# Altium schematic sheet 3_MCU.SchDoc
size 420 x 297 mm; SheetNumber: 3; SheetTotal: 5
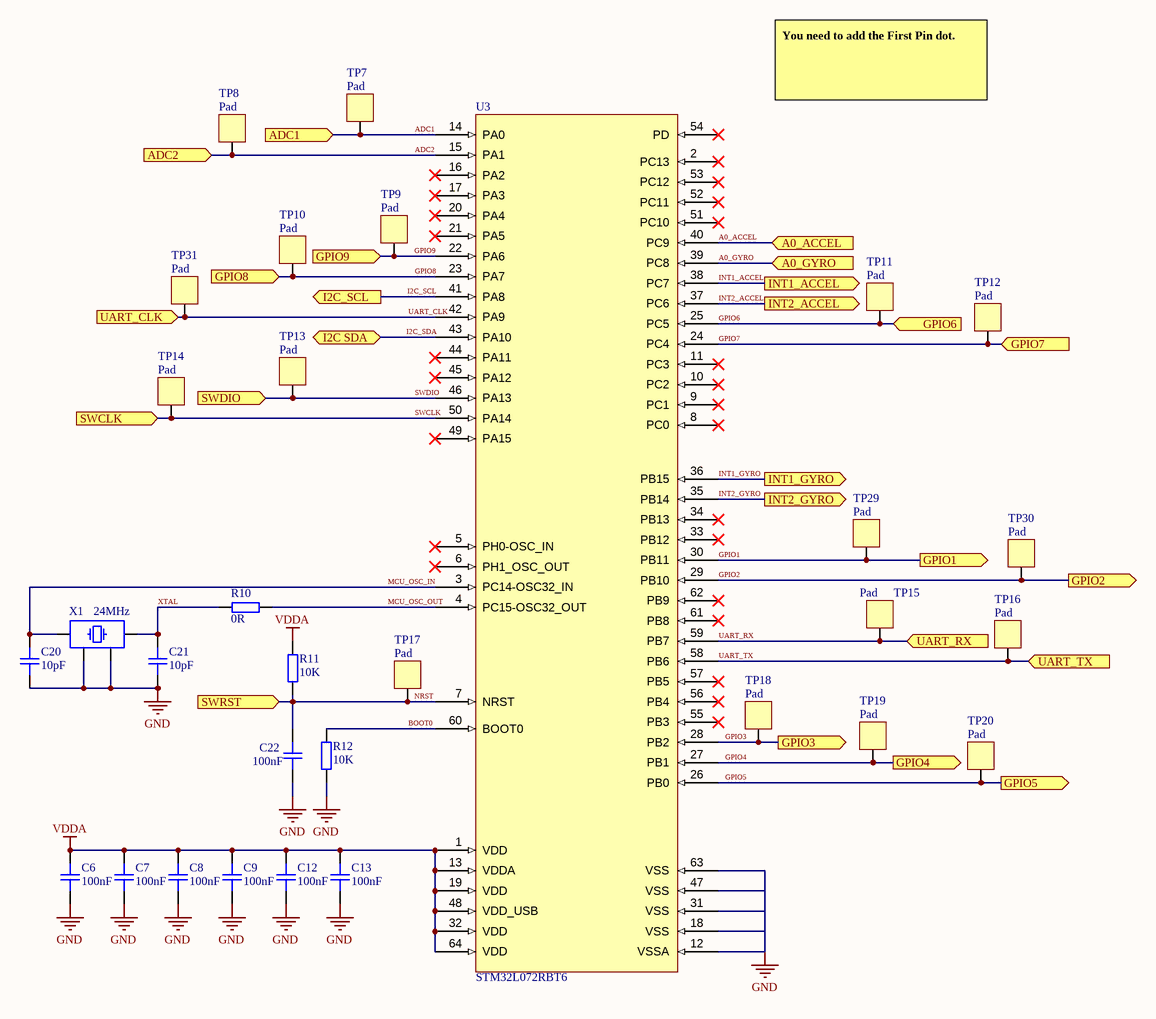
[diagram p0: 3_MCU.SchDoc]

## Parts
C6  100nF  [CAP_0603]
C7  100nF  [CAP_0603]
C8  100nF  [CAP_0603]
C9  100nF  [CAP_0603]
C12  100nF  [CAP_0603]
C13  100nF  [CAP_0603]
C20  10pF  [CAP_0402]
C21  10pF  [CAP_0402]
C22  100nF  [CAP_0603]
R10  0R  [RES_0603]
R11  10K  [RES_0603]
R12  10K  [RES_0603]
TP7  Pad  [PAD_SQ_2MM]  (no BOM)
TP8  Pad  [PAD_SQ_2MM]  (no BOM)
TP9  Pad  [PAD_SQ_2MM]  (no BOM)
TP10  Pad  [PAD_SQ_2MM]  (no BOM)
TP11  Pad  [PAD_SQ_2MM]  (no BOM)
TP12  Pad  [PAD_SQ_2MM]  (no BOM)
TP13  Pad  [PAD_SQ_2MM]  (no BOM)
TP14  Pad  [PAD_SQ_2MM]  (no BOM)
TP15  Pad  [PAD_SQ_2MM]  (no BOM)
TP16  Pad  [PAD_SQ_2MM]  (no BOM)
TP17  Pad  [PAD_SQ_2MM]  (no BOM)
TP18  Pad  [PAD_SQ_2MM]  (no BOM)
TP19  Pad  [PAD_SQ_2MM]  (no BOM)
TP20  Pad  [PAD_SQ_2MM]  (no BOM)
TP29  Pad  [PAD_SQ_2MM]  (no BOM)
TP30  Pad  [PAD_SQ_2MM]  (no BOM)
TP31  Pad  [PAD_SQ_2MM]  (no BOM)
U3  STM32L072RBT6  [LQFP64 - 64-pin]
X1  24MHz  [XTAL_2520]

## Ports
A0_ACCEL (in, see 1_BLOCK[3C], 4_DIGITAL[1C]), A0_GYRO (in, see 1_BLOCK[3C], 4_DIGITAL[1C]), ADC1 (in, see 1_BLOCK[3C], 5_OUTPUTS[1D]), ADC2 (in, see 1_BLOCK[3C], 5_OUTPUTS[2D]), GPIO1 (out, see 1_BLOCK[3B], 5_OUTPUTS[1B]), GPIO2 (out, see 1_BLOCK[3B], 5_OUTPUTS[1B]), GPIO3 (out, see 1_BLOCK[3B], 5_OUTPUTS[1B]), GPIO4 (out, see 1_BLOCK[3B], 5_OUTPUTS[2B]), GPIO5 (out, see 1_BLOCK[3B], 5_OUTPUTS[2B]), GPIO6 (in, see 1_BLOCK[3B], 5_OUTPUTS[2C]), GPIO7 (in, see 1_BLOCK[3B], 5_OUTPUTS[2C]), GPIO8 (in, see 1_BLOCK[3B], 5_OUTPUTS[2C]), GPIO9 (in, see 1_BLOCK[3B], 5_OUTPUTS[2C]), I2C SDA (bidir, see 1_BLOCK[3C], 4_DIGITAL[2C]), I2C_SCL (out, see 1_BLOCK[3C], 4_DIGITAL[2C]), INT1_ACCEL (out, see 1_BLOCK[3C], 4_DIGITAL[3C]), INT1_GYRO (out, see 1_BLOCK[3C], 4_DIGITAL[4C]), INT2_ACCEL (out, see 1_BLOCK[3C], 4_DIGITAL[0C], 4_DIGITAL[3C]), INT2_GYRO (out, see 1_BLOCK[3C], 4_DIGITAL[4C]), SWCLK (in, see 1_BLOCK[3C]), SWDIO (in, see 1_BLOCK[3C]), SWRST (in, see 1_BLOCK[3C]), UART_CLK (in, see 1_BLOCK[3C]), UART_RX (in, see 1_BLOCK[3C]), UART_TX (in, see 1_BLOCK[3C])

## Nets
GND: C6.1 C7.1 C8.1 C9.1 C12.1 C13.1 C20.1 C21.1 C22.1 R12.1 U3.12(VSSA) U3.18(VSS) U3.31(VSS) U3.47(VSS) U3.63(VSS) X1.2 X1.4
VDDA: C6.2 C7.2 C8.2 C9.2 C12.2 C13.2 R11.2 U3.1(VDD) U3.13(VDDA) U3.19(VDD) U3.32(VDD) U3.48(VDD_USB) U3.64(VDD)
A0_ACCEL: U3.40(PC9) ; port A0_ACCEL
A0_GYRO: U3.39(PC8) ; port A0_GYRO
ADC1: TP7.1 U3.14(PA0) ; port ADC1
ADC2: TP8.1 U3.15(PA1) ; port ADC2
BOOT0: R12.2 U3.60(BOOT0)
GPIO1: TP29.1 U3.30(PB11) ; port GPIO1
GPIO2: TP30.1 U3.29(PB10) ; port GPIO2
GPIO3: TP18.1 U3.28(PB2) ; port GPIO3
GPIO4: TP19.1 U3.27(PB1) ; port GPIO4
GPIO5: TP20.1 U3.26(PB0) ; port GPIO5
GPIO6: TP11.1 U3.25(PC5) ; port GPIO6
GPIO7: TP12.1 U3.24(PC4) ; port GPIO7
GPIO8: TP10.1 U3.23(PA7) ; port GPIO8
GPIO9: TP9.1 U3.22(PA6) ; port GPIO9
I2C_SCL: U3.41(PA8) ; port I2C_SCL
I2C_SDA: U3.43(PA10) ; port I2C SDA
INT1_ACCEL: U3.38(PC7) ; port INT1_ACCEL
INT1_GYRO: U3.36(PB15) ; port INT1_GYRO
INT2_ACCEL: U3.37(PC6) ; port INT2_ACCEL
INT2_GYRO: U3.35(PB14) ; port INT2_GYRO
MCU_OSC_IN: C20.2 U3.3(PC14-OSC32_IN) X1.1
MCU_OSC_OUT: R10.2 U3.4(PC15-OSC32_OUT)
NRST: C22.2 R11.1 TP17.1 U3.7(NRST) ; port SWRST
SWCLK: TP14.1 U3.50(PA14) ; port SWCLK
SWDIO: TP13.1 U3.46(PA13) ; port SWDIO
UART_CLK: TP31.1 U3.42(PA9) ; port UART_CLK
UART_RX: TP15.1 U3.59(PB7) ; port UART_RX
UART_TX: TP16.1 U3.58(PB6) ; port UART_TX
XTAL: C21.2 R10.1 X1.3

Not connected (* = marked no-connect by the designer): U3 2(PC13)* 5(PH0-OSC_IN)* 6(PH1_OSC_OUT)* 8(PC0)* 9(PC1)* 10(PC2)* 11(PC3)* 16(PA2)* 17(PA3)* 20(PA4)* 21(PA5)* 33(PB12)* 34(PB13)* 44(PA11)* 45(PA12)* 49(PA15)* 51(PC10)* 52(PC11)* 53(PC12)* 54(PD)* 55(PB3)* 56(PB4)* 57(PB5)* 61(PB8)* 62(PB9)*

## Notes on the sheet
- You need to add the First Pin dot.
- THIS DOCUMENT AND THE DATA DISCLOSED HEREIN OR
- HEREWITH IS THE PROPERTY OF ALTIUM LIMITED AND MAY
- DWG NO:
- REVISION
- REV:
- DESCRIPTION
- DATE
- APPROVED
- BE FREELY DISTRIBUTED IN WHOLE. NO RIGHTS ARE
- RESERVED OR EXPRESS OR IMPLIED WARANTEE GIVEN.
- ENG:
- APPROVALS
- PROJECT
- DSN:
- CHK:
- REFERENCE DOCUMENTS
- PROJECT REVISION:
- TITLE
- DOCUMENT REVISION:
- DESIGN ITEM:
- BOM:
- FAB DWG:
- PCB DWG:
- ASSY DWG:
- SCALE:
- A3
- SIZE
- CAGE CODE
- FILE NAME
- DWG NO.
- SHEET
- OF
- REV

## Library data of the parts
C6-C9 C12 C13 C22 = CAP_0603_16V: Capacitor SMD 0603 16V
C20 C21 = CAP_0402_16V: Capacitor SMD 0402 16V
R10-R12 = RES_0603: Resistor SMD 0603; Manufacturer: *; Manufacturer Part Number: *; Distributor Link: *
TP7-TP20 TP29-TP31 = PAD_SQ_2MM: Test Point Square 2mm
U3 = STM32L072RBT6: 128KB 1.8V~3.6V ARM-MSeries 20KB 32MHz FLASH 51 LQFP-64(10x10) Microcontroller Units (MCUs/MPUs/SOCs) ROHS
X1 = XTAL_2520: Crystal SMD 2520; Distributor Link: *